# Altium project Pomo_DriverBoard.PrjPcb
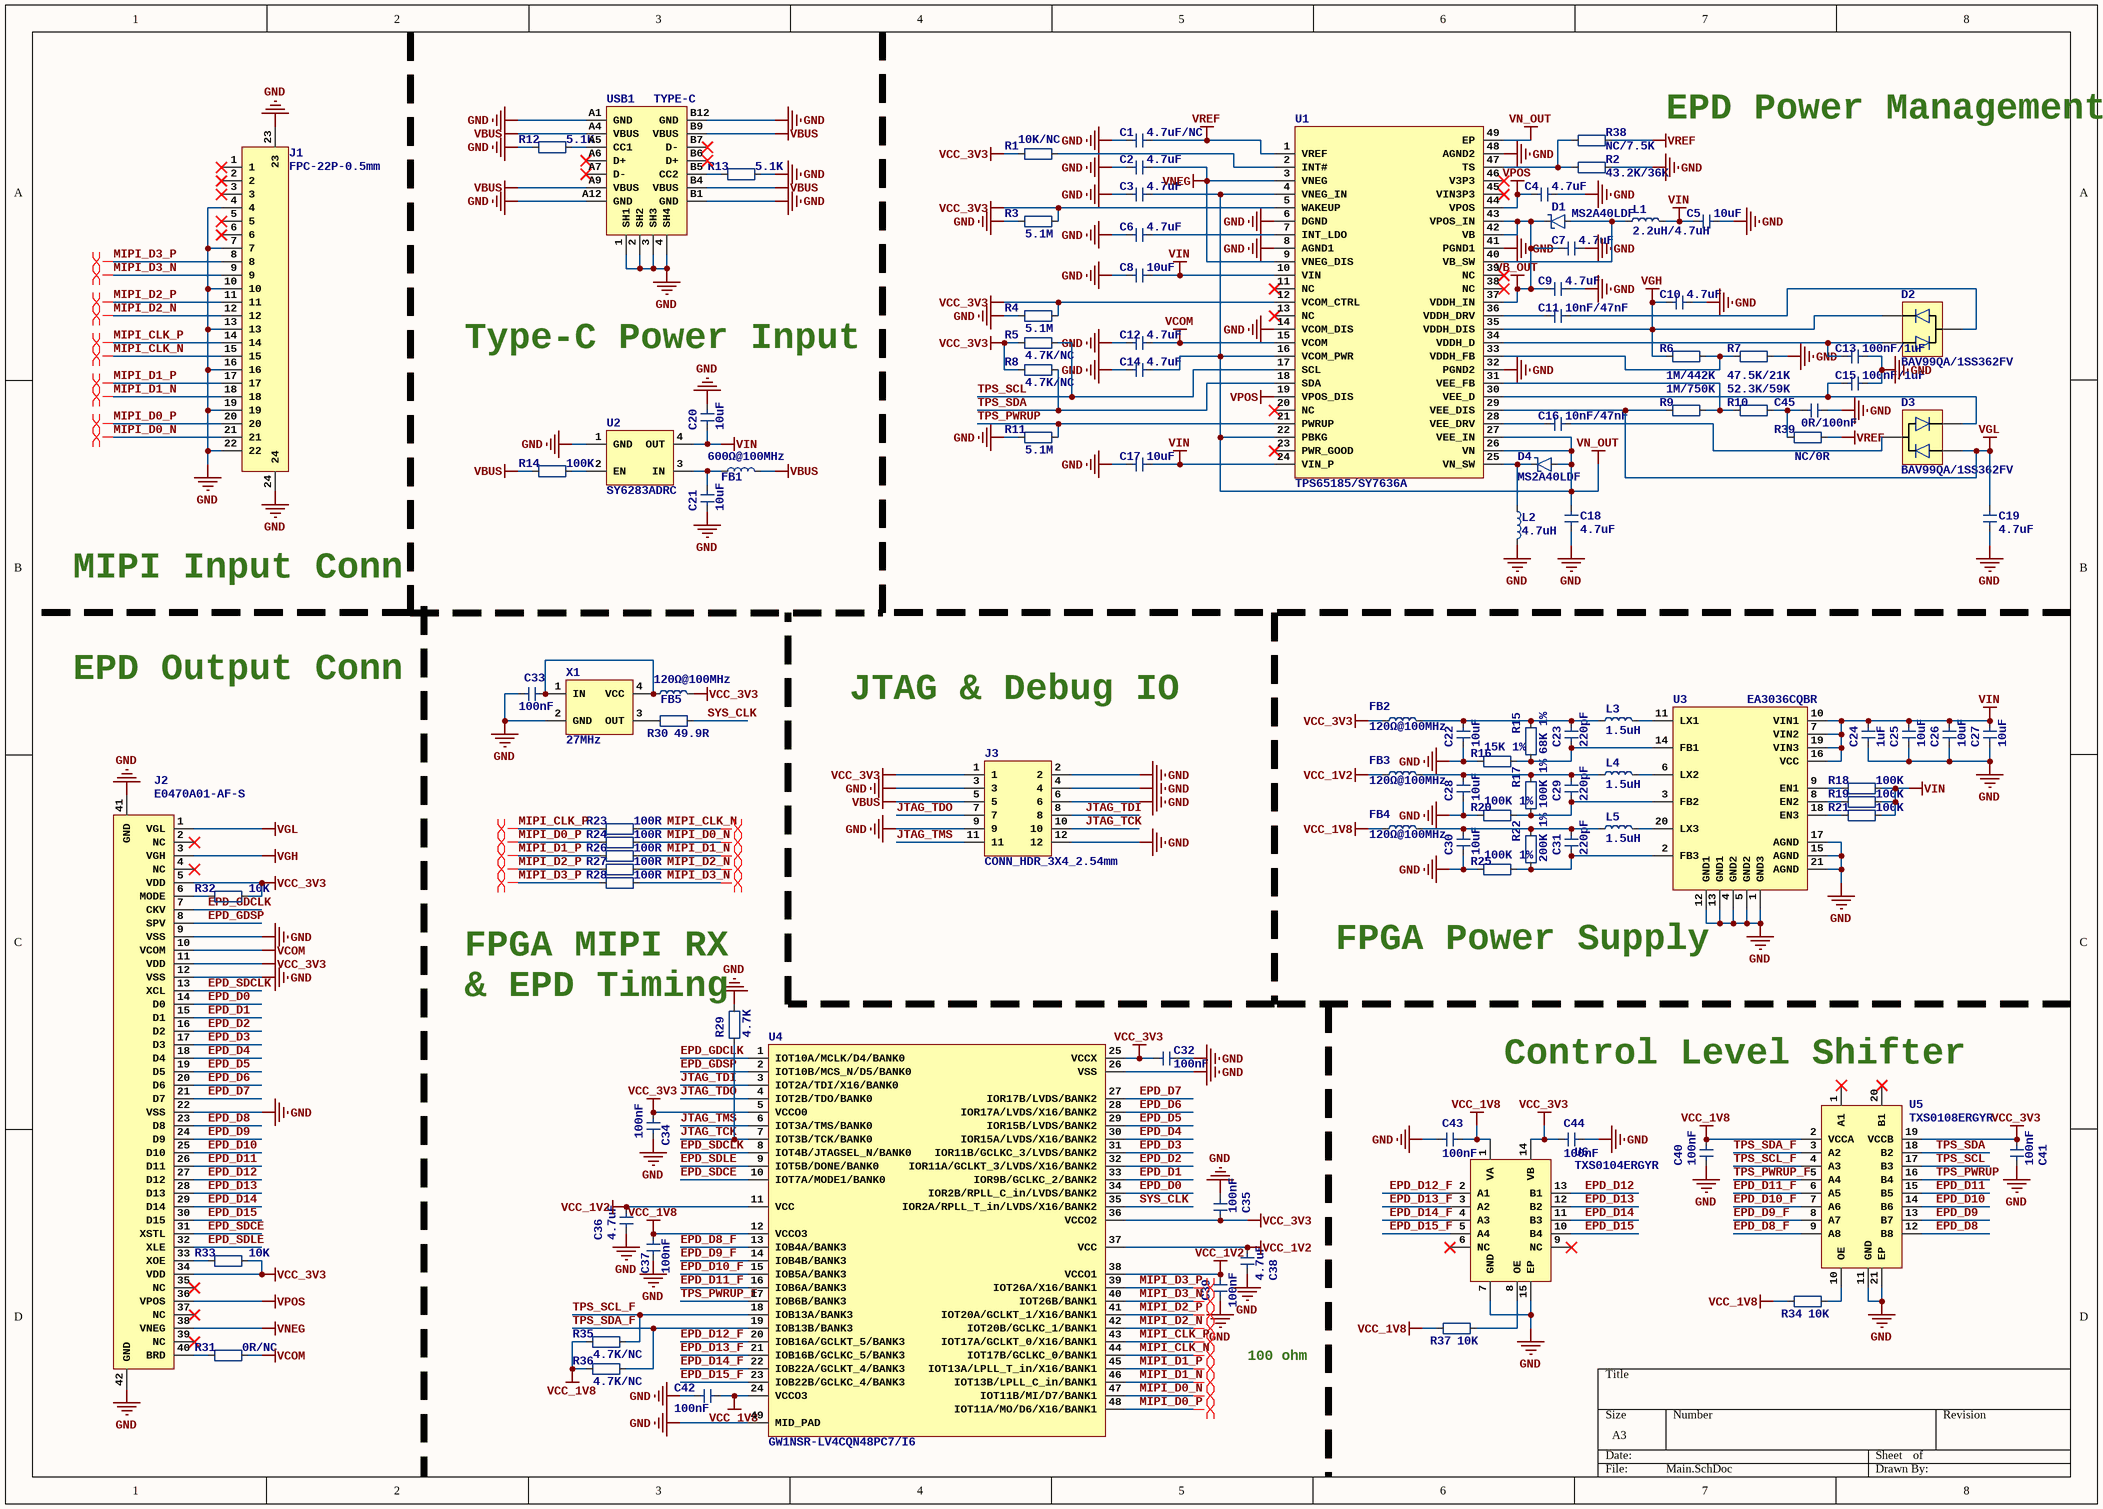
[diagram p0: Main.SchDoc]
1 sheet, 109 parts. Net scope: global (net labels, ports and power ports of the same name join across sheets).
Board file: PCB.PcbDoc

## Sheet Main.SchDoc
size A3

### Parts
C1  4.7uF/NC  [Capacitor-0402]
C2  4.7uF  [Capacitor-0805]
C3  4.7uF  [Capacitor-0805]
C4  4.7uF  [Capacitor-0805]
C5  10uF  [Capacitor-0603]
C6  4.7uF  [Capacitor-0402]
C7  4.7uF  [Capacitor-0805]
C8  10uF  [Capacitor-0603]
C9  4.7uF  [Capacitor-0805]
C10  4.7uF  [Capacitor-0805]
C11  10nF/47nF  [Capacitor-0402]
C12  4.7uF  [Capacitor-0402]
C13  100nF/1uF  [Capacitor-0402]
C14  4.7uF  [Capacitor-0805]
C15  100nF/1uF  [Capacitor-0402]
C16  10nF/47nF  [Capacitor-0402]
C17  10uF  [Capacitor-0603]
C18  4.7uF  [Capacitor-0805]
C19  4.7uF  [Capacitor-0805]
C20  10uF  [Capacitor-0402]
C21  10uF  [Capacitor-0402]
C22  10uF  [Capacitor-0402]
C23  220pF  [Capacitor-0402]
C24  1uF  [Capacitor-0402]
C25  10uF  [Capacitor-0402]
C26  10uF  [Capacitor-0402]
C27  10uF  [Capacitor-0402]
C28  10uF  [Capacitor-0402]
C29  220pF  [Capacitor-0402]
C30  10uF  [Capacitor-0402]
C31  220pF  [Capacitor-0402]
C32  100nF  [Capacitor-0402]
C33  100nF  [Capacitor-0402]
C34  100nF  [Capacitor-0402]
C35  100nF  [Capacitor-0402]
C36  4.7uF  [Capacitor-0402]
C37  100nF  [Capacitor-0402]
C38  4.7uF  [Capacitor-0402]
C39  100nF  [Capacitor-0402]
C40  100nF  [Capacitor-0402]
C41  100nF  [Capacitor-0402]
C42  100nF  [Capacitor-0402]
C43  100nF  [Capacitor-0402]
C44  100nF  [Capacitor-0402]
C45  0R/100nF  [Capacitor-0402]
D1  MS2A40LDF  [MS2A40LDF-DFN-2_1.6x1.0mm]
D2  BAV99QA/1SS362FV  [BAV99QA-DFN-3_1.1x1.0mm]
D3  BAV99QA/1SS362FV  [BAV99QA-DFN-3_1.1x1.0mm]
D4  MS2A40LDF  [MS2A40LDF-DFN-2_1.6x1.0mm]
FB1  600Ω@100MHz  [Ferrite Bead-0603]
FB2  120Ω@100MHz  [Ferrite Bead-0402]
FB3  120Ω@100MHz  [Ferrite Bead-0402]
FB4  120Ω@100MHz  [Ferrite Bead-0402]
FB5  120Ω@100MHz  [Ferrite Bead-0402]
J1  FPC-22P-0.5mm  [HC-FPC-05-10-22RLTAG]
J2  E0470A01-AF-S  [E0470A01-AF-S]
J3  CONN_HDR_3X4_2.54mm  [CONN_HDR_3X4_2.54mm]
L1  2.2uH/4.7uH  [Inductor-2016]
L2  4.7uH  [Inductor-2016]
L3  1.5uH  [Inductor-2016]
L4  1.5uH  [Inductor-2016]
L5  1.5uH  [Inductor-2016]
R1  10K/NC  [Resistor-0402]
R2  43.2K/36K  [Resistor-0402]
R3  5.1M  [Resistor-0402]
R4  5.1M  [Resistor-0402]
R5  4.7K/NC  [Resistor-0402]
R6  1M/442K  [Resistor-0402]
R7  47.5K/21K  [Resistor-0402]
R8  4.7K/NC  [Resistor-0402]
R9  1M/750K  [Resistor-0402]
R10  52.3K/59K  [Resistor-0402]
R11  5.1M  [Resistor-0402]
R12  5.1K  [Resistor-0402]
R13  5.1K  [Resistor-0402]
R14  100K  [Resistor-0402]
R15  68K 1%  [Resistor-0402]
R16  15K 1%  [Resistor-0402]
R17  100K 1%  [Resistor-0402]
R18  100K  [Resistor-0402]
R19  100K  [Resistor-0402]
R20  100K 1%  [Resistor-0402]
R21  100K  [Resistor-0402]
R22  200K 1%  [Resistor-0402]
R23  100R  [Resistor-0402]
R24  100R  [Resistor-0402]
R25  100K 1%  [Resistor-0402]
R26  100R  [Resistor-0402]
R27  100R  [Resistor-0402]
R28  100R  [Resistor-0402]
R29  4.7K  [Resistor-0402]
R30  49.9R  [Resistor-0402]
R31  0R/NC  [Resistor-0402]
R32  10K  [Resistor-0402]
R33  10K  [Resistor-0402]
R34  10K  [Resistor-0402]
R35  4.7K/NC  [Resistor-0402]
R36  4.7K/NC  [Resistor-0402]
R37  10K  [Resistor-0402]
R38  NC/7.5K  [Resistor-0402]
R39  NC/0R  [Resistor-0402]
U1  TPS65185/SY7636A  [TPS65185-VQFN-48_6x6mm]
U2  SY6283ADRC  [SY6283ADRC-dfn-4_1.2x1.6mm]
U3  EA3036CQBR  [EA3036-QFN-20]
U4  GW1NSR-LV4CQN48PC7/I6  [GW1NSR-LV4CQN48P-QFN-48_6X6]
U5  TXS0108ERGYR  [TXS0108E-VQFN-20-3.5x4.5mm]
U6  TXS0104ERGYR  [TXS0104E-VQFN-14-3.5x3.5mm]
USB1  TYPE-C  [TYPE-C-16P]
X1  27MHz  [Oscillator-2016]

### Nets
GND: C1.1 C2.1 C3.1 C4.2 C5.2 C6.1 C7.2 C8.1 C9.2 C10.2 C12.1 C13.2 C14.1 C15.2 C17.1 C18.1 C19.1 C20.2 C21.1 C22.1 C24.1 C25.1 C26.1 C27.1 C28.1 C30.1 C32.2 C33.2 C34.1 C35.2 C36.1 C37.1 C38.1 C39.1 C40.1 C41.1 C42.2 C43.2 C44.1 C45.1 J1.4 J1.7 J1.10 J1.13 J1.16 J1.19 J1.22 J1.23 J1.24 J2.9(VSS) J2.12(VSS) J2.22(VSS) J2.41(GND) J2.42(GND) J3.2 J3.3 J3.4 J3.6 J3.9 J3.12 L2.2 R2.1 R3.2 R4.2 R7.1 R11.2 R12.2 R13.1 R16.2 R20.2 R25.2 R29.2 U1.6(DGND) U1.8(AGND1) U1.14(VCOM_DIS) U1.32(PGND2) U1.41(PGND1) U1.48(AGND2) U2.1(GND) U3.1(GND3) U3.4(GND2) U3.5(GND2) U3.12(GND1) U3.13(GND1) U3.15(AGND) U3.17(AGND) U3.21(AGND) U4.26(VSS) U4.49(MID_PAD) U5.11(GND) U5.21(EP) U6.7(GND) U6.15(EP) USB1.1(SH1) USB1.2(SH2) USB1.3(SH3) USB1.4(SH4) USB1.A1(GND) USB1.A12(GND) USB1.B1(GND) USB1.B12(GND) X1.2(GND)
VB_OUT: C7.1 C9.1 D1.1 U1.37(VDDH_IN) U1.42(VB) U1.43(VPOS_IN)
VBUS: FB1.2 J3.5 R14.2 USB1.A4(VBUS) USB1.A9(VBUS) USB1.B4(VBUS) USB1.B9(VBUS)
VCC_1V2: C36.2 C38.2 C39.2 FB3.1 U4.11(VCC) U4.37(VCC) U4.38(VCCO1)
VCC_1V8: C37.2 C40.2 C42.1 C43.1 FB4.1 R34.2 R35.2 R36.2 R37.2 U4.12(VCCO3) U4.24(VCCO3) U5.2(VCCA) U6.1(VA)
VCC_3V3: C32.1 C34.2 C35.1 C41.2 C44.2 FB2.1 FB5.2 J2.5(VDD) J2.11(VDD) J2.34(VDD) J3.1 R1.2 R3.1 R4.1 R5.2 R8.2 R32.1 R33.1 U1.5(WAKEUP) U1.12(VCOM_CTRL) U4.5(VCCO0) U4.25(VCCX) U4.36(VCCO2) U5.19(VCCB) U6.14(VB)
VCOM: C12.2 J2.10(VCOM) R31.1 U1.15(VCOM)
VGH: C10.1 D2.2 J2.3(VGH) R6.2 U1.35(VDDH_DIS)
VGL: C19.2 D3.1 J2.1(VGL) R9.2 U1.29(VEE_DIS)
VIN: C5.1 C8.2 C17.2 C20.1 C24.2 C25.2 C26.2 C27.2 L1.2 R18.1 R19.1 R21.1 U1.10(VIN) U1.24(VIN_P) U2.4(OUT) U3.7(VIN2) U3.10(VIN1) U3.16(VCC) U3.19(VIN3)
VN_OUT: C3.2 C14.2 C18.2 D4.2 U1.4(VNEG_IN) U1.16(VCOM_PWR) U1.22(PBKG) U1.26(VN) U1.27(VEE_IN) U1.49(EP)
VNEG: C2.2 J2.38(VNEG) U1.3(VNEG) U1.9(VNEG_DIS)
VPOS: C4.1 J2.36(VPOS) U1.19(VPOS_DIS) U1.44(VPOS)
VREF: C1.2 R38.1 R39.1 U1.1(VREF)
EPD_D0: J2.14(D0) U4.34(IOR2B/RPLL_C_in/LVDS/BANK2)
EPD_D1: J2.15(D1) U4.33(IOR9B/GCLKC_2/BANK2)
EPD_D2: J2.16(D2) U4.32(IOR11A/GCLKT_3/LVDS/X16/BANK2)
EPD_D3: J2.17(D3) U4.31(IOR11B/GCLKC_3/LVDS/BANK2)
EPD_D4: J2.18(D4) U4.30(IOR15A/LVDS/X16/BANK2)
EPD_D5: J2.19(D5) U4.29(IOR15B/LVDS/BANK2)
EPD_D6: J2.20(D6) U4.28(IOR17A/LVDS/X16/BANK2)
EPD_D7: J2.21(D7) U4.27(IOR17B/LVDS/BANK2)
EPD_D8: J2.23(D8) U5.12(B8)
EPD_D8_F: U4.13(IOB4A/BANK3) U5.9(A8)
EPD_D9: J2.24(D9) U5.13(B7)
EPD_D9_F: U4.14(IOB4B/BANK3) U5.8(A7)
EPD_D10: J2.25(D10) U5.14(B6)
EPD_D10_F: U4.15(IOB5A/BANK3) U5.7(A6)
EPD_D11: J2.26(D11) U5.15(B5)
EPD_D11_F: U4.16(IOB6A/BANK3) U5.6(A5)
EPD_D12: J2.27(D12) U6.13(B1)
EPD_D12_F: U4.20(IOB16A/GCLKT_5/BANK3) U6.2(A1)
EPD_D13: J2.28(D13) U6.12(B2)
EPD_D13_F: U4.21(IOB16B/GCLKC_5/BANK3) U6.3(A2)
EPD_D14: J2.29(D14) U6.11(B3)
EPD_D14_F: U4.22(IOB22A/GCLKT_4/BANK3) U6.4(A3)
EPD_D15: J2.30(D15) U6.10(B4)
EPD_D15_F: U4.23(IOB22B/GCLKC_4/BANK3) U6.5(A4)
EPD_GDCLK: J2.7(CKV) U4.1(IOT10A/MCLK/D4/BANK0)
EPD_GDSP: J2.8(SPV) U4.2(IOT10B/MCS_N/D5/BANK0)
EPD_SDCE: J2.31(XSTL) U4.10(IOT7A/MODE1/BANK0)
EPD_SDCLK: J2.13(XCL) U4.8(IOT4B/JTAGSEL_N/BANK0)
EPD_SDLE: J2.32(XLE) U4.9(IOT5B/DONE/BANK0)
JTAG_TCK: J3.10 R29.1 U4.7(IOT3B/TCK/BANK0)
JTAG_TDI: J3.8 U4.3(IOT2A/TDI/X16/BANK0)
JTAG_TDO: J3.7 U4.4(IOT2B/TDO/BANK0)
JTAG_TMS: J3.11 U4.6(IOT3A/TMS/BANK0)
MIPI_CLK_N: J1.15 R23.1 U4.44(IOT17B/GCLKC_0/BANK1)
MIPI_CLK_P: J1.14 R23.2 U4.43(IOT17A/GCLKT_0/X16/BANK1)
MIPI_D0_N: J1.21 R24.1 U4.47(IOT11B/MI/D7/BANK1)
MIPI_D0_P: J1.20 R24.2 U4.48(IOT11A/MO/D6/X16/BANK1)
MIPI_D1_N: J1.18 R26.1 U4.46(IOT13B/LPLL_C_in/BANK1)
MIPI_D1_P: J1.17 R26.2 U4.45(IOT13A/LPLL_T_in/X16/BANK1)
MIPI_D2_N: J1.12 R27.1 U4.42(IOT20B/GCLKC_1/BANK1)
MIPI_D2_P: J1.11 R27.2 U4.41(IOT20A/GCLKT_1/X16/BANK1)
MIPI_D3_N: J1.9 R28.1 U4.40(IOT26B/BANK1)
MIPI_D3_P: J1.8 R28.2 U4.39(IOT26A/X16/BANK1)
SYS_CLK: R30.1 U4.35(IOR2A/RPLL_T_in/LVDS/X16/BANK2)
TPS_PWRUP: R11.1 U1.21(PWRUP) U5.16(B4)
TPS_PWRUP_F: U4.17(IOB6B/BANK3) U5.5(A4)
TPS_SCL: R5.1 U1.17(SCL) U5.17(B3)
TPS_SCL_F: R35.1 U4.18(IOB13A/BANK3) U5.4(A3)
TPS_SDA: R8.1 U1.18(SDA) U5.18(B2)
TPS_SDA_F: R36.1 U4.19(IOB13B/BANK3) U5.3(A2)
NetC6_2: C6.2 U1.7(INT_LDO)
NetC11_1: C11.1 U1.36(VDDH_DRV)
NetC11_2: C11.2 D2.3
NetC13_1: C13.1 D2.1 U1.34(VDDH_D)
NetC15_1: C15.1 D3.2 U1.30(VEE_D)
NetC16_1: C16.1 U1.28(VEE_DRV)
NetC16_2: C16.2 D3.3
NetC21_2: C21.2 FB1.1 U2.3(IN)
NetC22_2: C22.2 C23.2 FB2.2 L3.1 R15.2
NetC23_1: C23.1 R15.1 R16.1 U3.14(FB1)
NetC28_2: C28.2 C29.2 FB3.2 L4.1 R17.2
NetC29_1: C29.1 R17.1 R20.1 U3.3(FB2)
NetC30_2: C30.2 C31.2 FB4.2 L5.1 R22.2
NetC31_1: C31.1 R22.1 R25.1 U3.2(FB3)
NetC33_1: C33.1 FB5.1 X1.1(IN) X1.4(VCC)
NetC45_2: C45.2 R10.1 R39.2
NetD1_2: D1.2 L1.1 U1.40(VB_SW)
NetD4_1: D4.1 L2.1 U1.25(VN_SW)
NetJ2_6: J2.6(MODE) R32.2
NetJ2_33: J2.33(XOE) R33.2
NetJ2_40: J2.40(BRD) R31.2
NetL3_2: L3.2 U3.11(LX1)
NetL4_2: L4.2 U3.6(LX2)
NetL5_2: L5.2 U3.20(LX3)
NetR1_1: R1.1 U1.2(INT#)
NetR2_2: R2.2 R38.2 U1.47(TS)
NetR6_1: R6.1 R7.2 U1.33(VDDH_FB)
NetR9_1: R9.1 R10.2 U1.31(VEE_FB)
NetR12_1: R12.1 USB1.A5(CC1)
NetR13_2: R13.2 USB1.B5(CC2)
NetR14_1: R14.1 U2.2(EN)
NetR18_2: R18.2 U3.9(EN1)
NetR19_2: R19.2 U3.8(EN2)
NetR21_2: R21.2 U3.18(EN3)
NetR30_2: R30.2 X1.3(OUT)
NetR34_1: R34.1 U5.10(OE)
NetR37_1: R37.1 U6.8(OE)

Not connected (* = marked no-connect by the designer): J1 1* 2* 3* 5* 6*; J2 2(NC)* 4(NC)* 35(NC)* 37(NC)* 39(NC)*; U1 11(NC)* 13(NC)* 20(NC)* 23(PWR_GOOD)* 38(NC)* 39(NC)* 45(VIN3P3)* 46(V3P3)*; U5 1(A1)* 20(B1)*; U6 6(NC)* 9(NC)*; USB1 A6(D+)* A7(D-)* B6(D+)* B7(D-)*

### Layout directives
differential pair: MIPI_CLK_N, MIPI_CLK_P, MIPI_D0_N, MIPI_D0_P, MIPI_D1_N, MIPI_D1_P, MIPI_D2_N, MIPI_D2_P, MIPI_D3_N, MIPI_D3_P

### Notes on the sheet
- EPD Power Management
- Type-C Power Input
- MIPI Input Conn
- EPD Output Conn
- JTAG & Debug IO
- FPGA MIPI RX
- & EPD Timing
- FPGA Power Supply
- (near U5) Control Level Shifter
- 100 ohm

### Library data of the parts
C1 C6 C12 = Capacitor-0402: CL05A475MO5NUNC
C2-C4 C7 C9 C10 C14 C18 C19 = Capacitor-0805: CL21A475KBQNNNE
C5 C8 C17 = Capacitor-0603: CL10A106KP8NNNC
C11 C16 = Capacitor-0402: CL05B103KB5NNNC/CC0402KRX7R9BB473
C13 C15 = Capacitor-0402: 0402B104K500NT/HGC0402R5105K500NTEJ
C20-C22 C25-C28 C30 = Capacitor-0402: HGC0402R5106M100NTEJ
C23 C29 C31 = Capacitor-0402: CL05C221JB5NNNC
C24 = Capacitor-0402: HGC0402R5105K500NTEJ
C32-C35 C37 C39-C44 = Capacitor-0402: 100nF/X5R/25V
C36 C38 = Capacitor-0402: 4.7uF/X5R/10V
C45 = Capacitor-0402: CL05B104KB5NNNC
D1 D4 = MS2A40LDF: Schottky Diode-DFN-1610-2
D2 D3 = BAV99QA
FB1 = Ferrite Bead-0603: UPZ1608U601-1R3TF
FB2-FB5 = Ferrite Bead-0402: UPZ1005D121-1R3TF
J1 = FPC-22P-0.5mm: HC-FPC-05-10-22RLTAG
J2 = E0470A01-AF-S: AFC01-S40FCA-00
L1 = Inductor-2016: FTC201612S2R2MBCA/FTC201610S4R7MBCA
L2 = Inductor-2016: FTC201610S4R7MBCA
L3-L5 = Inductor-2016: FTC201610S1R5MBCA
R1-R39 = Resistor-0402
U1 = TPS65185
U4 = GW1NSR-LV4CQN48P
U5 = TXS0108E
U6 = TXS0104E
USB1 = TYPE-C: GT-USB-7010ASV
X1 = Oscillator_Source-2016: OC7EL89CJO-113YLC-27M